# Altium schematic sheet Power Page 2.SchDoc
size 406 x 304 mm; SheetNumber: 13; SheetTotal: 14
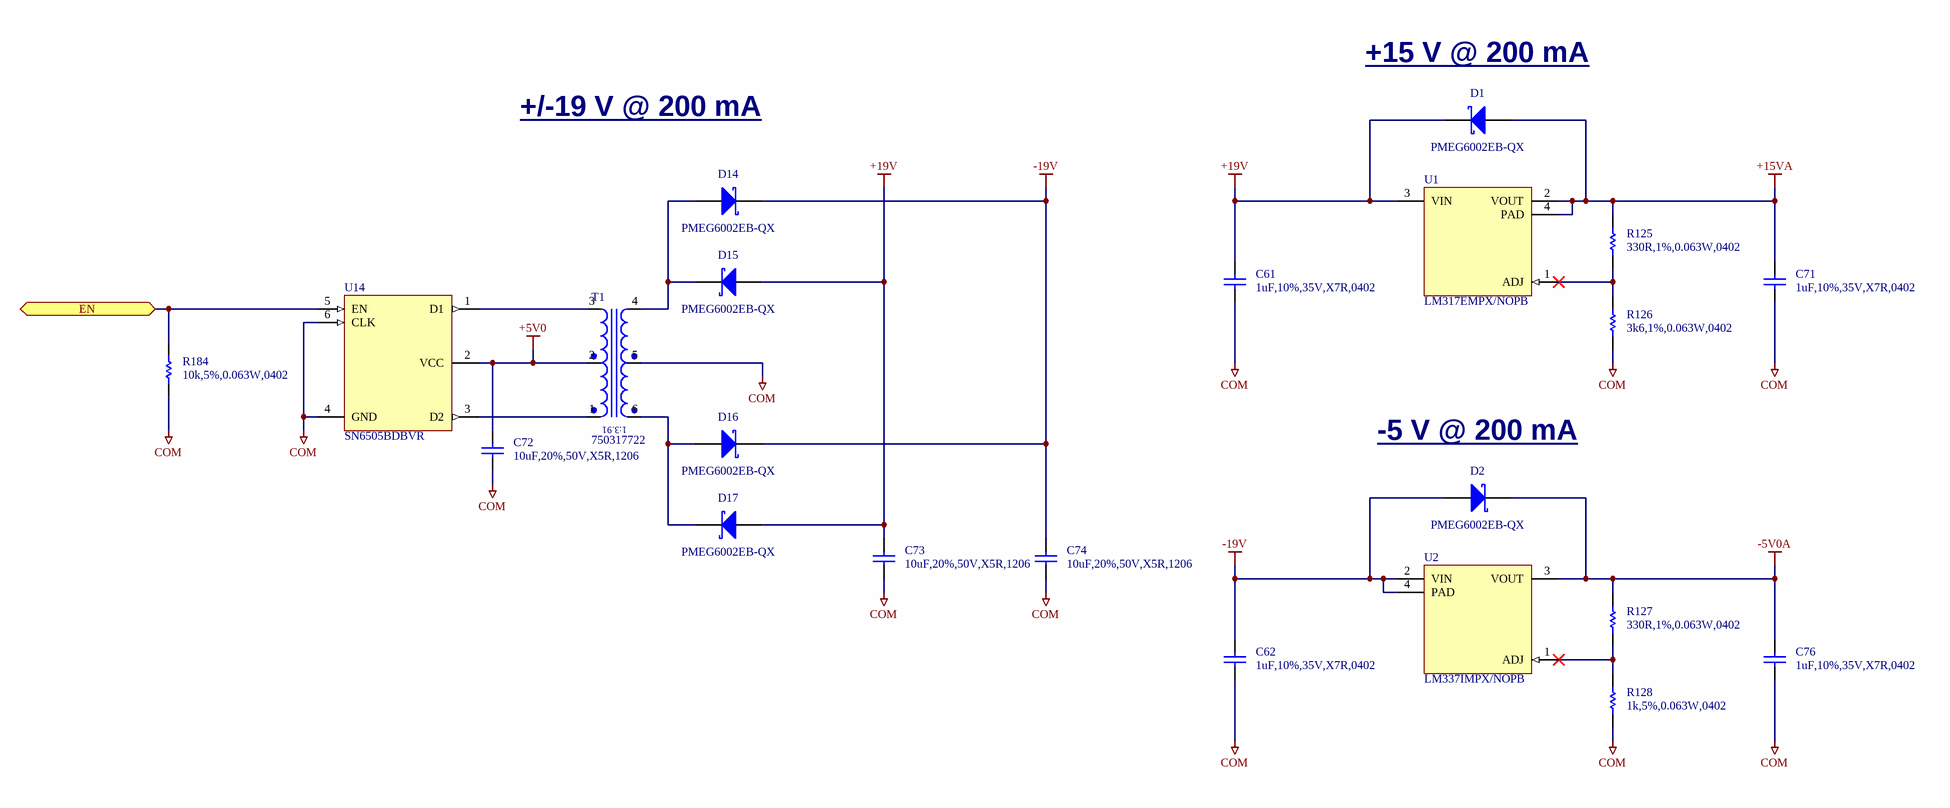
[diagram p0: Power Page 2.SchDoc]

## Parts
C61  1uF,10%,35V,X7R,0402  [CAPC1005X06N]
C62  1uF,10%,35V,X7R,0402  [CAPC1005X06N]
C71  1uF,10%,35V,X7R,0402  [CAPC1005X06N]
C72  10uF,20%,50V,X5R,1206  [CAPC3216X16N]
C73  10uF,20%,50V,X5R,1206  [CAPC3216X16N]
C74  10uF,20%,50V,X5R,1206  [CAPC3216X16N]
C76  1uF,10%,35V,X7R,0402  [CAPC1005X06N]
D1  PMEG6002EB-QX  [NEXPERIA_PKG_SOD523]
D2  PMEG6002EB-QX  [NEXPERIA_PKG_SOD523]
D14  PMEG6002EB-QX  [NEXPERIA_PKG_SOD523]
D15  PMEG6002EB-QX  [NEXPERIA_PKG_SOD523]
D16  PMEG6002EB-QX  [NEXPERIA_PKG_SOD523]
D17  PMEG6002EB-QX  [NEXPERIA_PKG_SOD523]
R125  330R,1%,0.063W,0402  [RESC1005X04N]
R126  3k6,1%,0.063W,0402  [RESC1005X04N]
R127  330R,1%,0.063W,0402  [RESC1005X04N]
R128  1k,5%,0.063W,0402  [RESC1005X04N]
R184  10k,5%,0.063W,0402  [RESC1005X04N]
T1  750317722  [WURTH_750317722]
U1  LM317EMPX/NOPB  [TEXASINSTRUMENTS_PKG_DCY]
U2  LM337IMPX/NOPB  [TEXASINSTRUMENTS_PKG_DCY]
U14  SN6505BDBVR  [TEXASINSTRUMENTS_PKG_DBV0006A]

## Ports
EN (bidir)

## Nets
+5V0: C72.2 T1.2(PCT) U14.2(VCC)
+15VA: C71.2 D1.2(A) R125.2 U1.2(VOUT) U1.4(PAD)
+19V: C61.2 C73.2 D1.1(K) D15.2(A) D17.2(A) U1.3(VIN)
-5V0A: C76.2 D2.1(K) R127.2 U2.3(VOUT)
-19V: C62.2 C74.2 D2.2(A) D14.1(K) D16.1(K) U2.2(VIN) U2.4(PAD)
COM: C61.1 C62.1 C71.1 C72.1 C73.1 C74.1 C76.1 R126.1 R128.1 R184.2 T1.5(SCT) U14.4(GND) U14.6(CLK)
EN: R184.1 U14.5(EN) ; port EN
NetD14_2: D14.2(A) D15.1(K) T1.4(S-)
NetD16_2: D16.2(A) D17.1(K) T1.6(S+)
NetR125_1: R125.1 R126.2 U1.1(ADJ)
NetR127_1: R127.1 R128.2 U2.1(ADJ)
NetT1_1: T1.1(P+) U14.3(D2)
NetT1_3: T1.3(P-) U14.1(D1)

## Notes on the sheet
- (near D1) +15 V @ 200 mA
- +/-19 V @ 200 mA
- (near D2) -5 V @ 200 mA
- Rev
- Sheet Name:
- Date:
- Sheet
- Designer:
- of
- (in symbol XFR,1-3.91,Lp=320uH,750317722) 1:3.91

## Library data of the parts
C61 C62 C71 C76 = CAP,Cer,1uF,35VDC,X5R,0402: 1 ï¿½F ï¿½10% 35V Ceramic Capacitor X5R 0402 (1005 Metric); Manufacturer 1: TDK Corporation; Manufacturer 1 Part Number: C1005X5R1V105K050BC; Vendor 1 Part Number: 445-9073-1-ND; Vendor 1: Digikey; Value: 1u; Part Name: CAP,Cer,1uF,35VDC,X5R,0402; CreatedBy: Judd Foster; HelpURL: https://product.tdk.com/info/en/catalog/datasheets/mlcc_commercial_general_en.pdf?ref_disty=digikey
C72-C74 = CAP,Cer,10uF,50VDC,X5R,1206: 10ï¿½F ï¿½20% 50V Ceramic Capacitor X5R 1206 (3216 Metric); Manufacturer 1: Samsung Electro-Mechanics; Manufacturer 1 Part Number: CL31A106MBHNNNE; Vendor 1 Part Number: 1276-6736-1-ND; Vendor 1: Digikey; Value: 10u; Part Name: CAP,Cer,10uF,50VDC,X5R,1206; CreatedBy: Judd Foster; HelpURL: https://www.samsungsem.com/resources/file/global/support/product_catalog/MLCC.pdf
D1 D2 D14-D17 = DIODE,Schottky,60V,200mA,SOD523: Diode 60 V 200mA Surface Mount SOD-523; Manufacturer 1: Nexperia USA Inc.; Vendor 1: DigiKey; Part Name: DIODE,Schottky,60V,200mA,SOD523; CreatedBy: Judd Foster; HelpURL: https://assets.nexperia.com/documents/data-sheet/PMEG6002EB-Q.pdf; Manufacturer 1 Part Number: PMEG6002EB-QX; Vendor 1 Part Number: PMEG6002EB-QX
R125 R127 = RES,330R,1%,0.063W,0402: 330 Ohms Â±1% 0.063W, 1/16W Chip Resistor 0402 (1005 Metric) Moisture Resistant Thick Film; Manufacturer 1: YAGEO; Manufacturer 1 Part Number: RC0402FR-07330RL; Vendor 1 Part Number: 311-330LRCT-ND; Vendor 1: DigiKey; Value: 330; Part Name: RES,330R,1%,0.063W,0402; CreatedBy: Judd Foster; HelpURL: https://www.yageo.com/upload/media/product/products/datasheet/rchip/PYu-RC_Group_51_RoHS_L_12.pdf
R126 = RES,3k6,1%,0.063W,0402: 62.5mW 3.6kÎ© 50V Â±100ppm/â„ƒ Thick Film Resistor Â±1% 0402 Chip Resistor - Surface Mount ROHS; Manufacturer 1: FOJAN; Manufacturer 1 Part Number: FRC0402F3601TS; Vendor 1 Part Number: C2998073; Vendor 1: LCSC; Part Name: RES,3k6,1%,0.063W,0402; CreatedBy: Judd Foster; HelpURL: https://www.lcsc.com/datasheet/C2998073.pdf
R128 = RES,1k,5%,0.063W,0402: 1 kOhms ï¿½5% 0.063W, 1/16W Chip Resistor 0402 (1005 Metric) Automotive AEC-Q200 Thick Film; Manufacturer 1: Stackpole Electronics Inc; Manufacturer 1 Part Number: RMCF0402JT1K00; Vendor 1 Part Number: RMCF0402JT1K00CT-ND; Vendor 1: DIgikey; Part Name: RES,1k,5%,0.063W,0402; CreatedBy: Judd Foster; HelpURL: https://www.seielect.com/catalog/sei-rmcf_rmcp.pdf; Value: 1k
R184 = RES,10k,5%,0.063W,0402: 10 kOhms ï¿½5% 0.063W, 1/16W Chip Resistor 0402 (1005 Metric) Automotive AEC-Q200 Thick Film; Manufacturer 1: Stackpole Electronics Inc; Manufacturer 1 Part Number: RMCF0402JT10K0; Vendor 1 Part Number: RMCF0402JT10K0CT-ND; Vendor 1: DIgikey; Part Name: RES,10k,5%,0.063W,0402; CreatedBy: Judd Foster; HelpURL: https://www.seielect.com/catalog/sei-rmcf_rmcp.pdf; Value: 10k
T1 = XFR,1-3.91,Lp=320uH,750317722: Push-Pull Converters For For DC/DC Converters SMPS Transformer 2500V Isolation 350 ~ 550kHz Surface Mount; Manufacturer 1: Wurth Elektronik; Vendor 1 Part Number: 732-750317722CT-ND; Vendor 1: DigiKey; Part Name: XFR,1-3.91,Lp=320uH,750317722; CreatedBy: Judd Foster; HelpURL: https://www.we-online.com/components/products/datasheet/750317722_valid_from_2025-12-17.pdf; Manufacturer 1 Part Number: 750317722
U1 = LM317EMPX_NOPB: 80dB@(120Hz) Positive Adjustable 1.25V~37V SOT-223-4 Voltage Regulators - Linear, Low Drop Out (LDO) Regulators RoHS; Manufacturer 1: Texas Instruments; Vendor 1 Part Number: C352843; Vendor 1: LCSC; Part Name: LM317EMPX_NOPB; CreatedBy: Judd Foster; HelpURL: https://www.lcsc.com/datasheet/C352843.pdf; Manufacturer 1 Part Number: LM317EMPX/NOPB
U2 = LM337IMPX_NOPB: Linear Voltage Regulator IC Negative Adjustable 1 Output 1.5A SOT-223-4; Manufacturer 1: Texas Instruments; Vendor 1 Part Number: LM337IMPX/NOPBCT-ND; Vendor 1: DigiKey; Part Name: LM337IMPX_NOPB; CreatedBy: Judd Foster; HelpURL: https://www.ti.com/lit/ds/symlink/lm137.pdf?HQS=dis-dk-null-digikeymode-dsf-pf-null-wwe&ts=1743290709590&ref_url=https%253A%252F%252Fwww.ti.com%252Fgeneral%252Fdocs%252Fsuppproductinfo.tsp%253FdistId%253D10%2526gotoUrl%253Dhttps%253A%252F%252Fwww.ti.com%2; Manufacturer 1 Part Number: LM337IMPX/NOPB
U14 = SN6505BDBVR: Transformer Driver PMIC SOT-23-6; Manufacturer 1: Texas Instruments; Vendor 1 Part Number: 296-47311-1-ND; Vendor 1: DigiKey; Part Name: SN6505BDBVR; CreatedBy: Judd Foster; HelpURL: https://www.ti.com/general/docs/suppproductinfo.tsp?distId=10&gotoUrl=https%3A%2F%2Fwww.ti.com%2Flit%2Fgpn%2Fsn6505a; Manufacturer 1 Part Number: SN6505BDBVR